# EAGLE design MMA7455 (EAGLE 5.10)
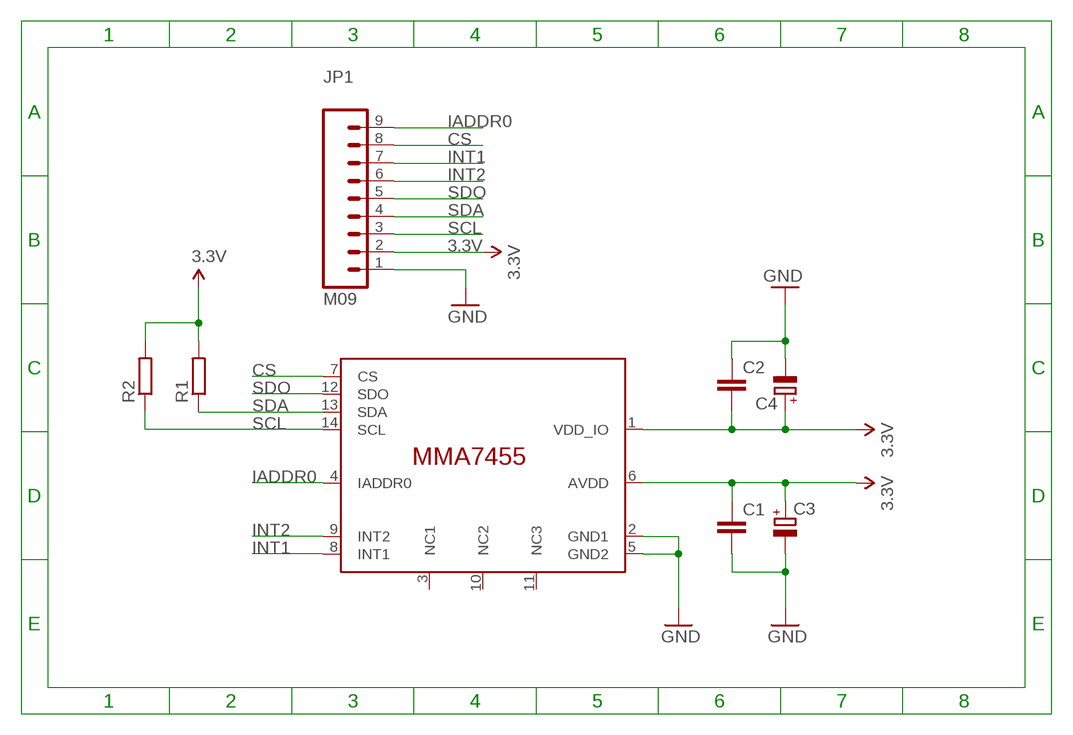
[diagram p0: schematic, sheet 1]

## Parts
C1  C-EUC0805  [C0805]
C2  C-EUC0805  [C0805]
C3  CPOL-EUB/3528-21R  [B/3528-21R]
C4  CPOL-EUB/3528-21R  [B/3528-21R]
JP1  M09  [1X09]
R1  R-EU_R0805  [R0805]
R2  R-EU_R0805  [R0805]
U12  MMA7455  [LGA14]

## Nets
3.3V: C1.1 C2.2 C3.+ C4.+ JP1.2 R1.2 R2.2 U12.1(VDD_IO) U12.6(AVDD)
CS: JP1.8 U12.7(CS)
GND: C1.2 C2.1 C3.- C4.- JP1.1 U12.2(GND1) U12.5(GND2)
IADDR0: JP1.9 U12.4(IADDR0)
INT1: JP1.7 U12.8(INT1)
INT2: JP1.6 U12.9(INT2)
SCL: JP1.3 R2.1 U12.14(SCL)
SDA: JP1.4 R1.1 U12.13(SDA)
SDO: JP1.5 U12.12(SDO)
Unconnected: U12.3(NC1) U12.10(NC2) U12.11(NC3)

## Library data of the parts
C1 C2 = rcl:C-EU: CAPACITOR, European symbol
C3 C4 = rcl:CPOL-EU: POLARIZED CAPACITOR, European symbol
JP1 = SparkFun:M09: Header 9 Standard 9-pin 0.1" header. Use with straight break away headers (SKU : PRT-00116), right angle break away headers (PRT-00553), swiss pins (PRT-00743), machine pins (PRT-00117), and female headers (PRT-00115).
R1 R2 = resistor:R-EU_: RESISTOR, European symbol
U12 = freescale:MMA7455

## Board
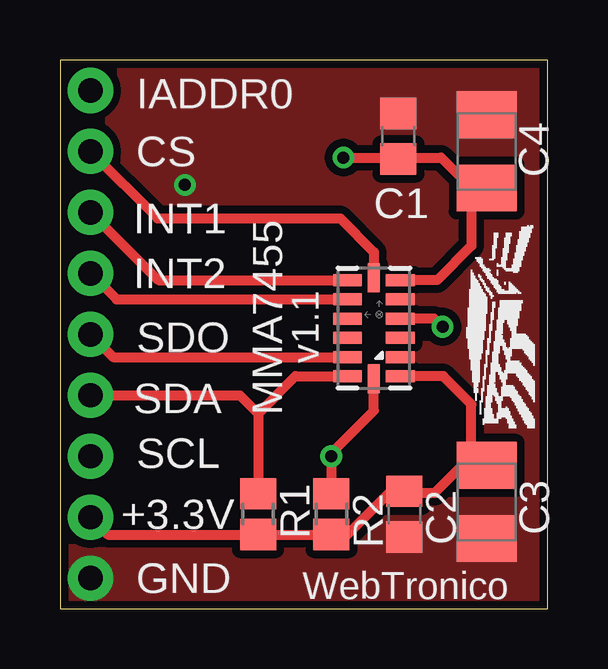
[diagram p1: board, top side]
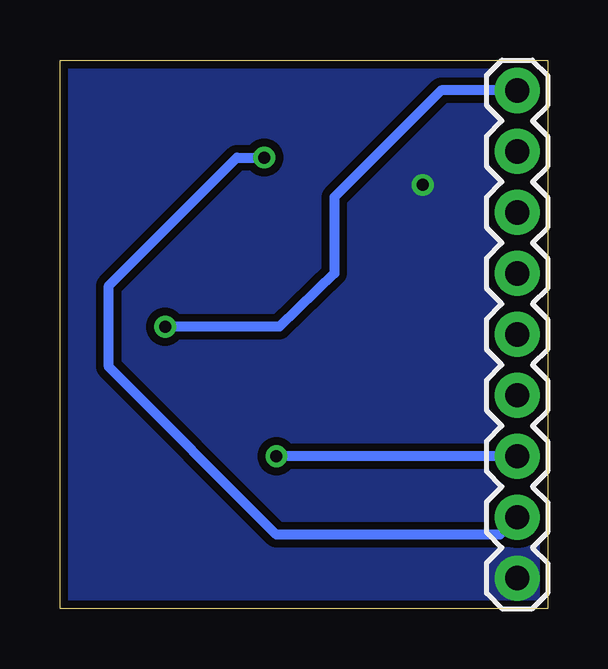
[diagram p2: board, bottom side, seen from below]

Size 20.32 x 22.86 mm. Coordinates in mm from the lower left corner, seen from the top.
Outline: 0,0 20.32,0 20.32,22.86 0,22.86 0,0
Copper layers (1*16): Top 0.035mm / dielectric 1.5mm / Bottom 0.035mm
Design rules "default *": minimum track width 10mil, minimum drill 24mil, track to track 8mil, track to pad 8mil, pad to pad 8mil, via to via 8mil, smd to smd 8mil, copper to edge 5mil, drill to drill 8mil, minimum pad ring 10mil, minimum via ring 8mil, stop-mask expansion 4mil, vias tented up to drill 0mil, thermal gap 10mil

### Footprints (pad centres in the part's own frame; a part is rotated, then mirrored left to right if it is on the bottom)
C0805 = smd 1.3 x 1.5: 1 -0.95,0; 2 0.95,0
B/3528-21R = smd 1.95 x 2.5: + 1.525,0; - -1.525,0
1X09 = drill 1.016 pad 1.88 round: 1 0,0; 2 2.54,0; 3 5.08,0; 4 7.62,0; 5 10.16,0; 6 12.7,0; 7 15.24,0; 8 17.78,0; 9 20.32,0
R0805 = smd 1.3 x 1.5: 1 -0.85,0; 2 0.85,0
LGA14 = smd 0.5 x 1.2: 1 4.54,2.37; 2 3.74,2.37; 3 2.94,2.37; 4 2.14,2.37; 5 1.34,2.37; 6 0.54,2.37; 8 0.54,0.17; 9 1.34,0.17; 10 2.14,0.17; 11 2.94,0.17; 12 3.74,0.17; 13 4.54,0.17 | smd 1.2 x 0.5: 7 0.44,1.27; 14 4.64,1.27

### Placement (x,y rotation side)
C1  14.1,19.68 90 top
C2  14.35,3.94 90 top
C3  17.78,4.45 90 top
C4  17.78,19.05 270 top
JP1  1.27,1.27 90 bottom
R1  8.26,3.94 270 top
R2  11.3,3.94 270 top
U12  11.81,14.22 270 top

### Tracks (layer width: path | path; a pad name or v marks a point on that pad's centre or on a via)
3.3V  (via drill 0.5)
  Top 0.406: 17.15,17.52 C4.+ | 17.15,17.52 15.88,18.8 14.16,18.8 | 17.27,5.97 16.77,5.97 15.62,4.83 14.41,4.83 C2.2 13.78,4.89 11.94,3.05 11.34,3.05 R2.2 R1.2 1.99,3.09 JP1.2 | 17.27,5.97 C3.+ | U12.6 15.72,13.68 17.14,15.11 17.14,17.52 17.15,17.52 | U12.1 15.97,9.68 17.14,8.51 17.14,6.1 17.27,5.97 | v11.81,18.8 14.16,18.8 | 14.16,18.8 C1.1
  Bottom 0.406: v11.81,18.8 12.95,18.8 18.29,13.46 18.29,10.07 R2.2 1.99,3.09 JP1.2
CS
  Top 0.406: U12.7 13.08,14.86 11.68,16.26 4.06,16.26 JP1.8
GND  (via drill 0.5)
  other vias: 5.21,17.65
  pour Bottom (isolate 0.33, no thermals): 0,22.86 20.32,22.86 20.32,0 0,0 0,9.14
  pour Top (isolate 0.33, no thermals): 0,22.86 20.32,22.86 20.32,0 0,0 0,9.14
IADDR0  (via drill 0.5)
  Top 0.406: U12.4 15.58,12.08 v15.94,11.75
  Bottom 0.406: v15.94,11.75 11.18,11.75 8.89,13.97 8.89,17.14 4.45,21.59 JP1.9
INT1
  Top 0.406: U12.8 4.1,13.68 JP1.7
INT2
  Top 0.406: U12.9 2.36,12.88 JP1.6
SCL  (via drill 0.5)
  Top 0.406: U12.14 13.08,8.26 11.3,6.48 11.3,6.22 | 11.3,6.22 R2.1 | v11.3,6.35 11.18,6.35 11.3,6.22
  Bottom 0.406: JP1.3 v11.3,6.35
SDA
  Top 0.406: U12.13 9.81,9.68 8.26,8.13 | 8.26,8.13 R1.1 | JP1.4 7.49,8.89 8.26,8.13
SDO
  Top 0.406: U12.12 2.22,10.48 JP1.5

### Text on the board
tNames: IADDR0 | CS | INT1 | INT2 | SDO | v1.1 | SDA | MMA7455 | SCL | +3.3V | GND | WebTronico
_tNames: C1 | C4 | R1 | R2 | C3 | C2